# EAGLE design tlcr-raspberry (EAGLE 6.5.0)
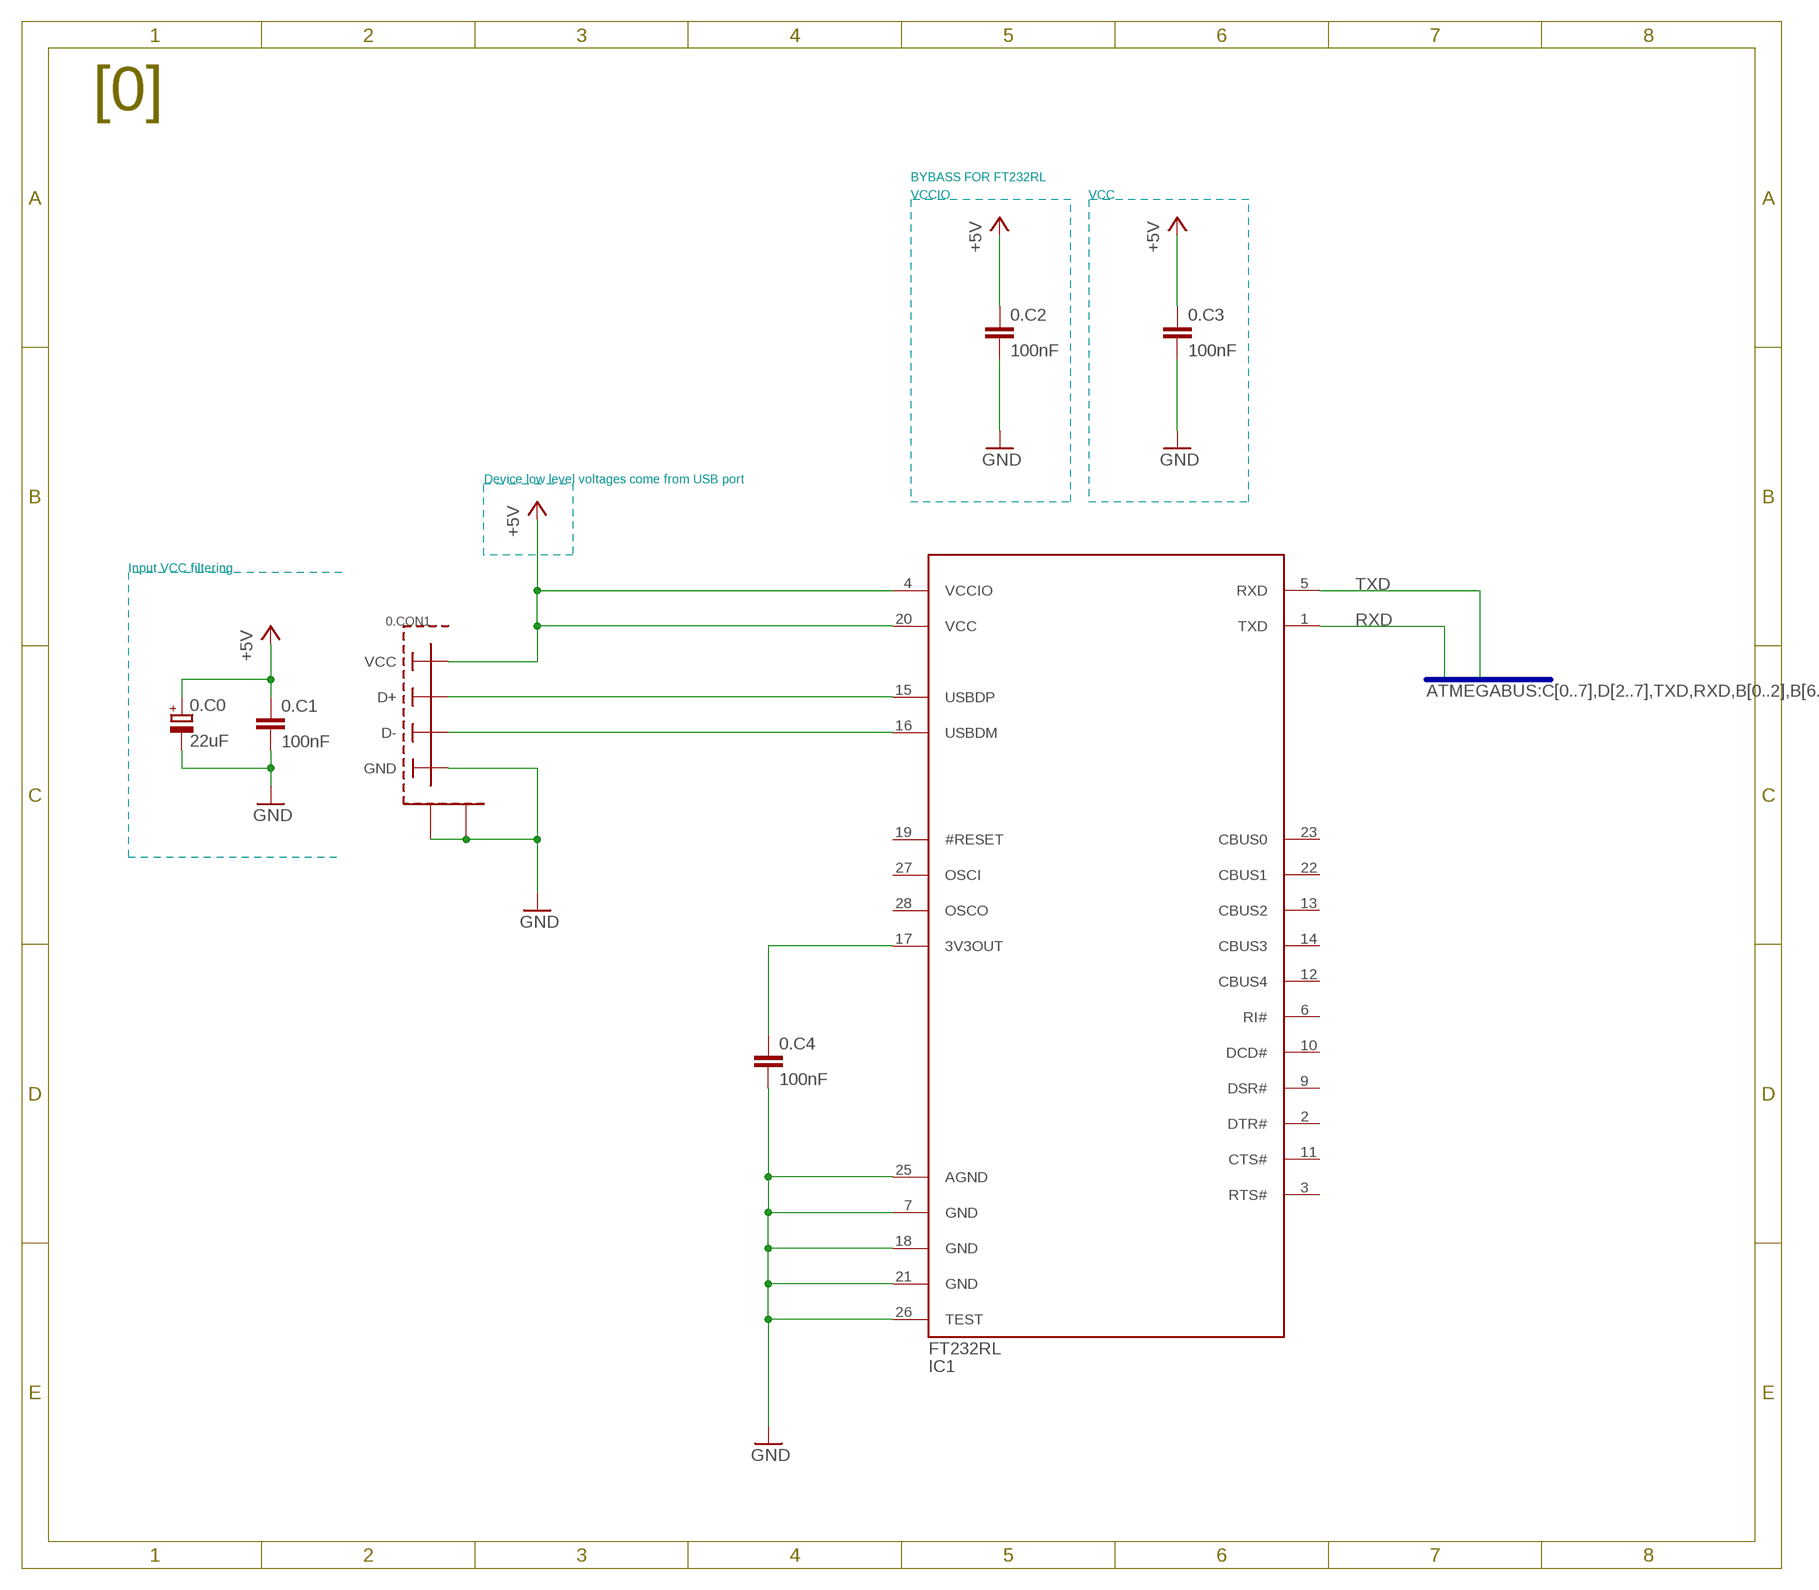
[diagram p0: schematic, sheet 1, part 1 of 2]
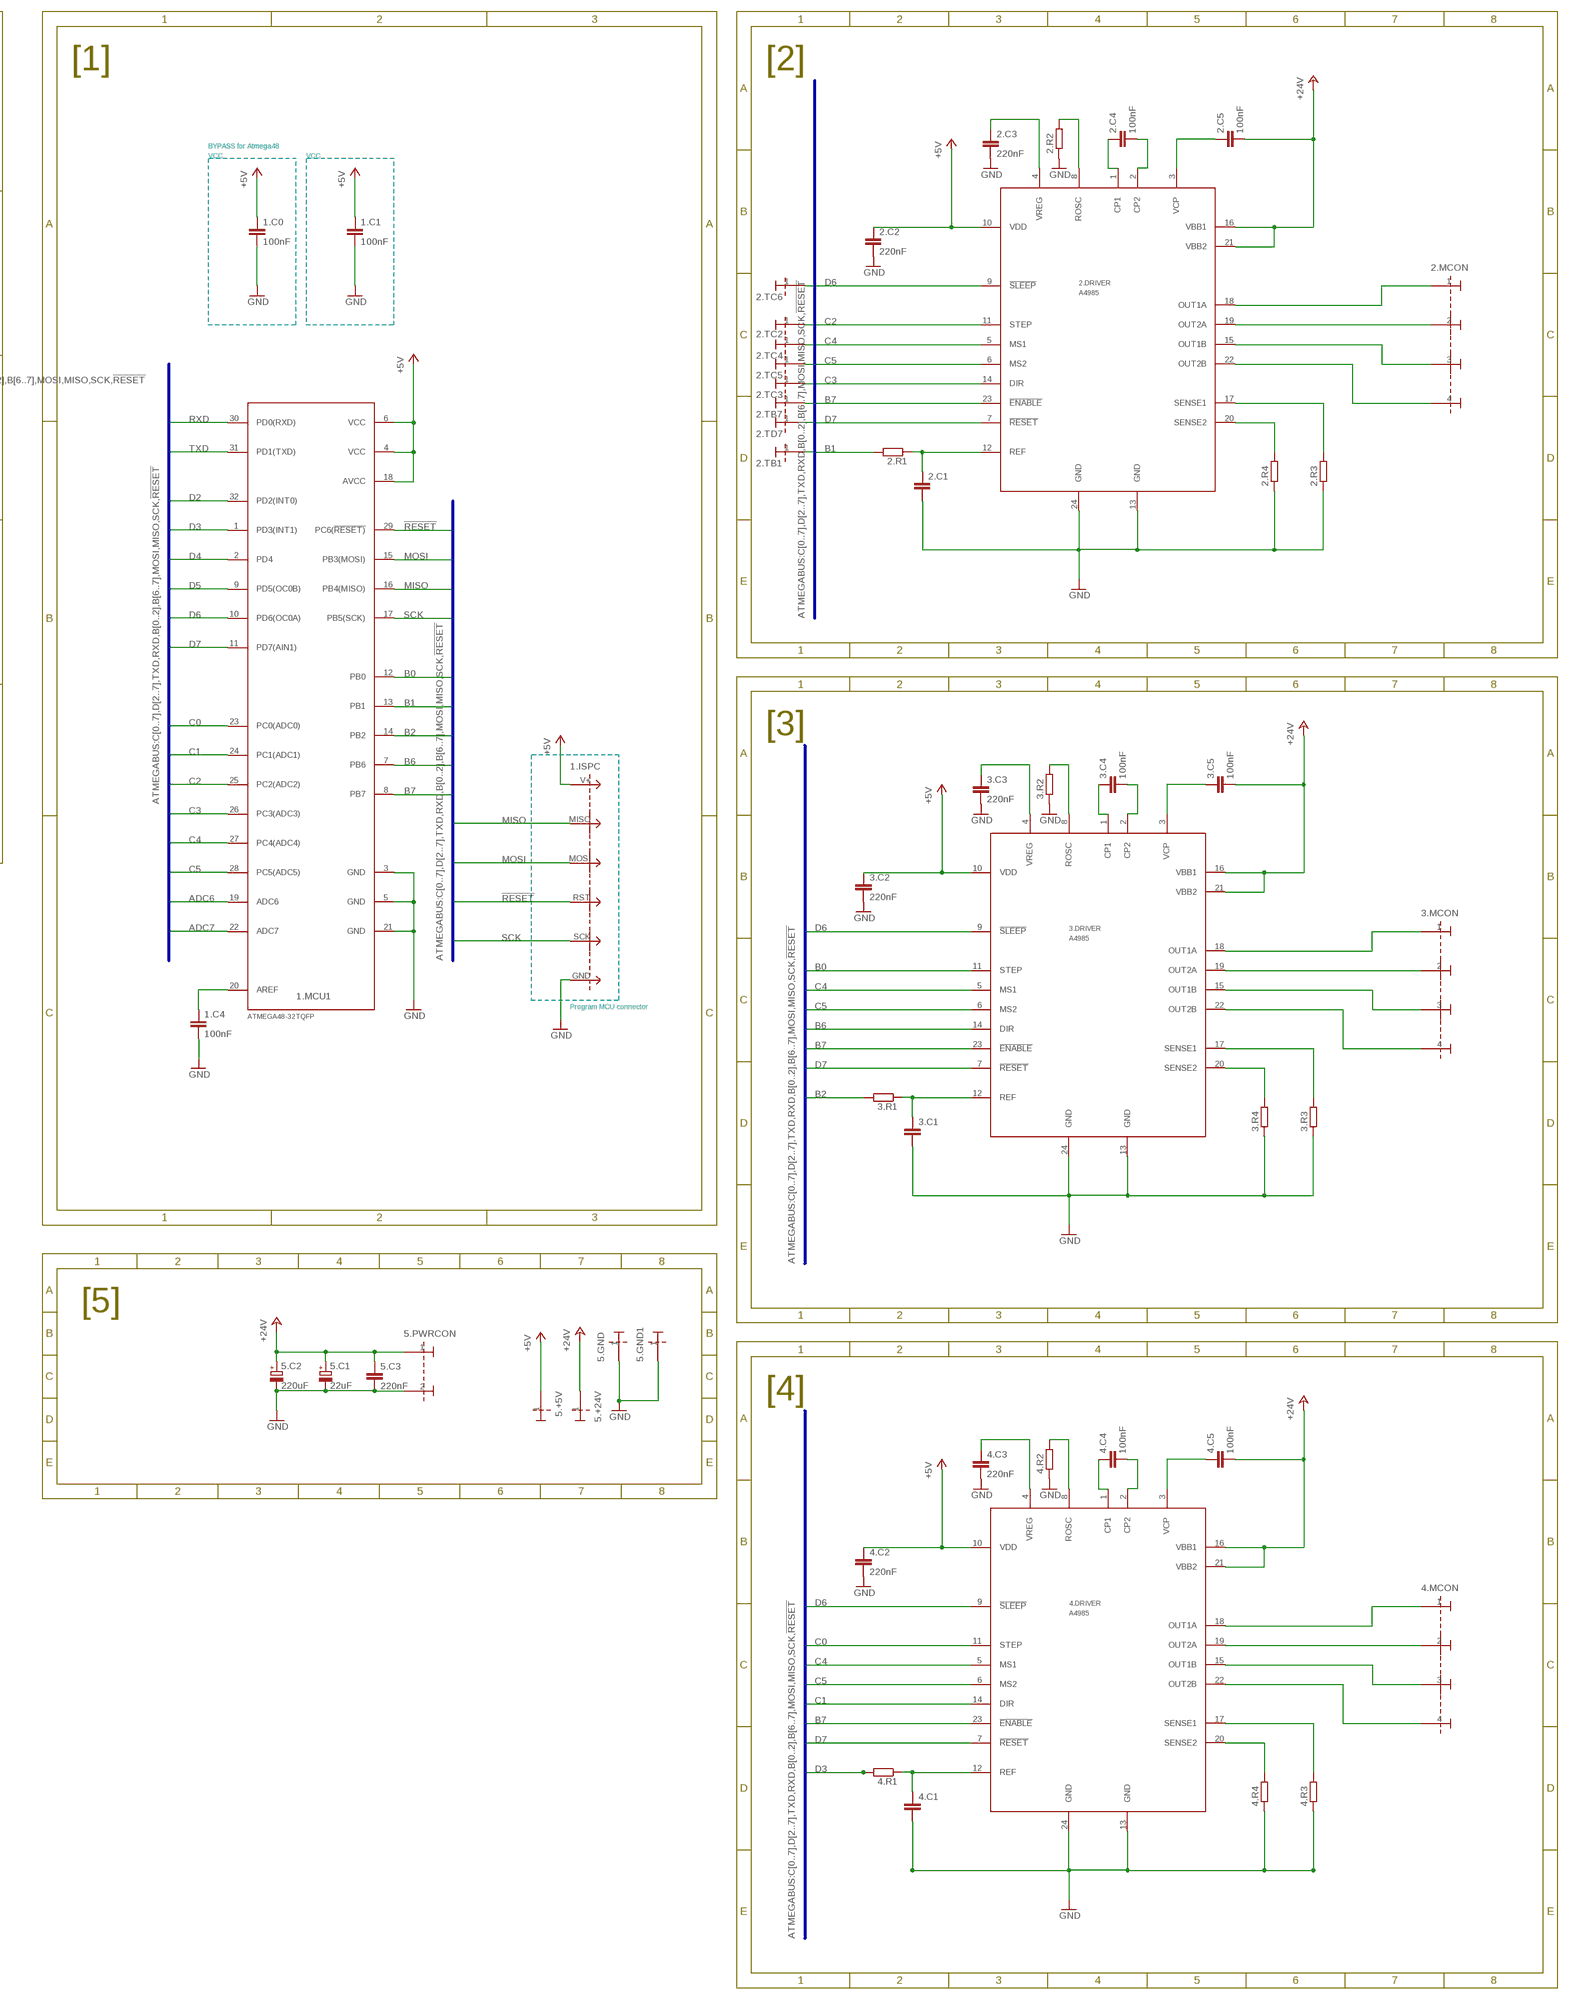
[diagram p1: schematic, sheet 1, part 2 of 2]

## Parts
0.C0  22uF  CPOL-EUE1.5-5  [E1.5-5]
0.C1  100nF  C-EUC0805  [C0805]
0.C2  100nF  C-EUC0805  [C0805]
0.C3  100nF  C-EUC0805  [C0805]
0.C4  100nF  C-EUC0805  [C0805]
0.CON1  USB-BWUERTH-ELECTRONIC-USB-B  [USB-B-THROUGH-HOLE]
1.C0  100nF  C-EUC0805  [C0805]
1.C1  100nF  C-EUC0805  [C0805]
1.C4  100nF  C-EUC0805  [C0805]
1.ISPC  CONNECTOR_6PIN2X3_ISP  [2X3_ISP]
1.MCU1  ATMEGA48-20PU-32TQFPTQFP32  [TQFP32-08]
2.C1  C-EUC0805  [C0805]
2.C2  220nF  C-EUC0805  [C0805]
2.C3  220nF  C-EUC0805  [C0805]
2.C4  100nF  C-EUC0805  [C0805]
2.C5  100nF  C-EUC0805  [C0805]
2.DRIVER  A4985  [SSOP24]
2.MCON  CONNECTOR_4PIN  [1X4_GENERIC]
2.R1  R-EU_R0805  [R0805]
2.R2  R-EU_R0805  [R0805]
2.R3  R-EU_R2010  [R2010]
2.R4  R-EU_R2010  [R2010]
2.TB1  CONNECTOR_1PIN1X1_HEADER  [1X1_GENERIC]
2.TB7  CONNECTOR_1PIN1X1_HEADER  [1X1_GENERIC]
2.TC2  CONNECTOR_1PIN1X1_HEADER  [1X1_GENERIC]
2.TC3  CONNECTOR_1PIN1X1_HEADER  [1X1_GENERIC]
2.TC4  CONNECTOR_1PIN1X1_HEADER  [1X1_GENERIC]
2.TC5  CONNECTOR_1PIN1X1_HEADER  [1X1_GENERIC]
2.TC6  CONNECTOR_1PIN1X1_HEADER  [1X1_GENERIC]
2.TD7  CONNECTOR_1PIN1X1_HEADER  [1X1_GENERIC]
3.C1  C-EUC0805  [C0805]
3.C2  220nF  C-EUC0805  [C0805]
3.C3  220nF  C-EUC0805  [C0805]
3.C4  100nF  C-EUC0805  [C0805]
3.C5  100nF  C-EUC0805  [C0805]
3.DRIVER  A4985  [SSOP24]
3.MCON  CONNECTOR_4PIN  [1X4_GENERIC]
3.R1  R-EU_R0805  [R0805]
3.R2  R-EU_R0805  [R0805]
3.R3  R-EU_R2010  [R2010]
3.R4  R-EU_R2010  [R2010]
4.C1  C-EUC0805  [C0805]
4.C2  220nF  C-EUC0805  [C0805]
4.C3  220nF  C-EUC0805  [C0805]
4.C4  100nF  C-EUC0805  [C0805]
4.C5  100nF  C-EUC0805  [C0805]
4.DRIVER  A4985  [SSOP24]
4.MCON  CONNECTOR_4PIN  [1X4_GENERIC]
4.R1  R-EU_R0805  [R0805]
4.R2  R-EU_R0805  [R0805]
4.R3  R-EU_R2010  [R2010]
4.R4  R-EU_R2010  [R2010]
5.+5V  CONNECTOR_1PIN1X1_HEADER  [1X1_GENERIC]
5.+24V  CONNECTOR_1PIN1X1_HEADER  [1X1_GENERIC]
5.C1  22uF  CPOL-EU140CLH-0810  [140CLH-0810]
5.C2  220uF  CPOL-EU140CLH-0810  [140CLH-0810]
5.C3  220nF  C-EUC0805  [C0805]
5.GND  CONNECTOR_1PIN1X1_HEADER  [1X1_GENERIC]
5.GND1  CONNECTOR_1PIN1X1_HEADER  [1X1_GENERIC]
5.PWRCON  CONNECTOR_2PIN1X2_WIRE  [1X2_WIRE]
IC1  FT232RL  [SSOP28]

## Nets
!RESET: 1.ISPC.RST 1.MCU1.29(PC6(!RESET))
+5V: 0.C0.+ 0.C1.1 0.C2.1 0.C3.1 0.CON1.VCC 1.C0.1 1.C1.1 1.ISPC.V+ 1.MCU1.4(VCC) 1.MCU1.6(VCC) 1.MCU1.18(AVCC) 2.C2.1 2.DRIVER.10(VDD) 3.C2.1 3.DRIVER.10(VDD) 4.C2.1 4.DRIVER.10(VDD) 5.+5V.1 IC1.4(VCCIO) IC1.20(VCC)
+24V: 2.C5.2 2.DRIVER.16(VBB1) 2.DRIVER.21(VBB2) 3.C5.2 3.DRIVER.16(VBB1) 3.DRIVER.21(VBB2) 4.C5.2 4.DRIVER.16(VBB1) 4.DRIVER.21(VBB2) 5.+24V.1 5.C1.+ 5.C2.+ 5.C3.1 5.PWRCON.1
ADC6: 1.MCU1.19(ADC6)
ADC7: 1.MCU1.22(ADC7)
B0: 1.MCU1.12(PB0) 3.DRIVER.11(STEP)
B1: 1.MCU1.13(PB1) 2.R1.2 2.TB1.1
B2: 1.MCU1.14(PB2) 3.R1.2
B6: 1.MCU1.7(PB6) 3.DRIVER.14(DIR)
B7: 1.MCU1.8(PB7) 2.DRIVER.23(!ENABLE) 2.TB7.1 3.DRIVER.23(!ENABLE) 4.DRIVER.23(!ENABLE)
C0: 1.MCU1.23(PC0(ADC0)) 4.DRIVER.11(STEP)
C1: 1.MCU1.24(PC1(ADC1)) 4.DRIVER.14(DIR)
C2: 1.MCU1.25(PC2(ADC2)) 2.DRIVER.11(STEP) 2.TC2.1
C3: 1.MCU1.26(PC3(ADC3)) 2.DRIVER.14(DIR) 2.TC3.1
C4: 1.MCU1.27(PC4(ADC4)) 2.DRIVER.5(MS1) 2.TC4.1 3.DRIVER.5(MS1) 4.DRIVER.5(MS1)
C5: 1.MCU1.28(PC5(ADC5)) 2.DRIVER.6(MS2) 2.TC5.1 3.DRIVER.6(MS2) 4.DRIVER.6(MS2)
D2: 1.MCU1.32(PD2(INT0))
D3: 1.MCU1.1(PD3(INT1)) 4.R1.2
D4: 1.MCU1.2(PD4)
D5: 1.MCU1.9(PD5(OC0B))
D6: 1.MCU1.10(PD6(OC0A)) 2.DRIVER.9(!SLEEP) 2.TC6.1 3.DRIVER.9(!SLEEP) 4.DRIVER.9(!SLEEP)
D7: 1.MCU1.11(PD7(AIN1)) 2.DRIVER.7(!RESET) 2.TD7.1 3.DRIVER.7(!RESET) 4.DRIVER.7(!RESET)
GND: 0.C0.- 0.C1.2 0.C2.2 0.C3.2 0.C4.2 0.CON1.GND 0.CON1.SHIELD 0.CON1.SHIELD@2(SHIELD) 1.C0.2 1.C1.2 1.C4.2 1.ISPC.GND 1.MCU1.3(GND) 1.MCU1.5(GND) 1.MCU1.21(GND) 2.C1.2 2.C2.2 2.C3.2 2.DRIVER.13(GND) 2.DRIVER.24(GND) 2.R2.1 2.R3.1 2.R4.1 3.C1.2 3.C2.2 3.C3.2 3.DRIVER.13(GND) 3.DRIVER.24(GND) 3.R2.1 3.R3.1 3.R4.1 4.C1.2 4.C2.2 4.C3.2 4.DRIVER.13(GND) 4.DRIVER.24(GND) 4.R2.1 4.R3.1 4.R4.1 5.C1.- 5.C2.- 5.C3.2 5.GND1.1 5.GND.1 5.PWRCON.2 IC1.7(GND) IC1.18(GND) IC1.21(GND) IC1.25(AGND) IC1.26(TEST)
MISO: 1.ISPC.MISO 1.MCU1.16(PB4(MISO))
MOSI: 1.ISPC.MOSI 1.MCU1.15(PB3(MOSI))
N$1: 1.C4.1 1.MCU1.20(AREF)
N$2: 2.C3.1 2.DRIVER.4(VREG)
N$3: 0.CON1.D+ IC1.15(USBDP)
N$4: 0.CON1.D- IC1.16(USBDM)
N$5: 2.C4.1 2.DRIVER.1(CP1)
N$6: 2.C4.2 2.DRIVER.2(CP2)
N$7: 0.C4.1 IC1.17(3V3OUT)
N$8: 2.C5.1 2.DRIVER.3(VCP)
N$9: 3.C3.1 3.DRIVER.4(VREG)
N$10: 2.DRIVER.18(OUT1A) 2.MCON.1
N$11: 2.DRIVER.19(OUT2A) 2.MCON.2
N$12: 2.DRIVER.15(OUT1B) 2.MCON.3
N$13: 2.DRIVER.22(OUT2B) 2.MCON.4
N$14: 2.DRIVER.17(SENSE1) 2.R3.2
N$15: 2.DRIVER.20(SENSE2) 2.R4.2
N$16: 3.C4.1 3.DRIVER.1(CP1)
N$18: 3.C4.2 3.DRIVER.2(CP2)
N$19: 2.DRIVER.8(ROSC) 2.R2.2
N$20: 3.C5.1 3.DRIVER.3(VCP)
N$21: 3.DRIVER.18(OUT1A) 3.MCON.1
N$22: 3.DRIVER.19(OUT2A) 3.MCON.2
N$23: 3.DRIVER.15(OUT1B) 3.MCON.3
N$24: 3.DRIVER.22(OUT2B) 3.MCON.4
N$25: 3.DRIVER.17(SENSE1) 3.R3.2
N$26: 3.DRIVER.20(SENSE2) 3.R4.2
N$28: 3.DRIVER.8(ROSC) 3.R2.2
N$29: 4.C3.1 4.DRIVER.4(VREG)
N$30: 4.C4.1 4.DRIVER.1(CP1)
N$31: 4.C4.2 4.DRIVER.2(CP2)
N$32: 4.C5.1 4.DRIVER.3(VCP)
N$33: 4.DRIVER.18(OUT1A) 4.MCON.1
N$34: 4.DRIVER.19(OUT2A) 4.MCON.2
N$35: 4.DRIVER.15(OUT1B) 4.MCON.3
N$36: 4.DRIVER.22(OUT2B) 4.MCON.4
N$37: 4.DRIVER.17(SENSE1) 4.R3.2
N$38: 4.DRIVER.20(SENSE2) 4.R4.2
N$40: 4.DRIVER.8(ROSC) 4.R2.2
N$41: 3.C1.1 3.DRIVER.12(REF) 3.R1.1
N$43: 4.C1.1 4.DRIVER.12(REF) 4.R1.1
N$45: 2.C1.1 2.DRIVER.12(REF) 2.R1.1
RXD: 1.MCU1.30(PD0(RXD)) IC1.1(TXD)
SCK: 1.ISPC.SCK 1.MCU1.17(PB5(SCK))
TXD: 1.MCU1.31(PD1(TXD)) IC1.5(RXD)
Unconnected: IC1.2(DTR#) IC1.3(RTS#) IC1.6(RI#) IC1.9(DSR#) IC1.10(DCD#) IC1.11(CTS#) IC1.12(CBUS4) IC1.13(CBUS2) IC1.14(CBUS3) IC1.19(#RESET) IC1.22(CBUS1) IC1.23(CBUS0) IC1.27(OSCI) IC1.28(OSCO)

## Buses
ATMEGABUS:C[0..7],D[2..7],TXD,RXD,B[0..2],B[6..7],MOSI,MISO,SCK,!RESET

## Notes on the sheet
- [0] | [1] | [2]
- BYBASS FOR FT232RL
- VCCIO | VCC
- BYPASS for Atmega48
- VCC | VCC
- Device low level voltages come from USB port
- Input VCC filtering
- [3]
- Program MCU connector
- [5]
- [4]

## Library data of the parts
0.C0 5.C1 5.C2 = RC_and_L:CPOL-EU: POLARIZED CAPACITOR, European symbol
0.C1-0.C4 1.C0 1.C1 1.C4 2.C1-2.C5 3.C1-3.C5 4.C1-4.C5 5.C3 = RC_and_L:C-EU: CAPACITOR, European symbol
0.CON1 = connectors:USB-B: USB, type B connector.; DATASHEET: http://www.farnell.com/datasheets/1442182.pdf; FARNELL: http://fi.farnell.com/jsp/search/productdetail.jsp?SKU=1642035
1.ISPC = connectors:CONNECTOR_6PIN
1.MCU1 = ic:ATMEGA48-20PU-32TQFP
2.DRIVER 3.DRIVER 4.DRIVER = ic:A4985: DMOS Microstepping Driver with Translator And Overcurrent Protection Datasheet <http://www.farnell.com/datasheets/1481256.pdf>
2.MCON 3.MCON 4.MCON = connectors:CONNECTOR_4PIN; PIN1: 1A; PIN2: 2A; PIN3: 1B; PIN4: 2B
2.R1-2.R4 3.R1-3.R4 4.R1-4.R4 = RC_and_L:R-EU_: RESISTOR, European symbol
2.TB1 2.TB7 2.TC2-2.TC6 2.TD7 5.+5V 5.+24V 5.GND 5.GND1 = connectors:CONNECTOR_1PIN
5.PWRCON = connectors:CONNECTOR_2PIN; PIN1: 24V; PIN2: GND
IC1 = ic:FT232RL: FTDI - FT232RL - IC, USB TO UART, SMD, SSOP28, 232; DATASHEET: http://www.farnell.com/datasheets/11529.pdf; FARNELL: http://fi.farnell.com/ftdi/ft232rl/ic-usb-to-uart-smd-ssop28-232/dp/1146032

## Net classes
0 default: width 0.305 mm
1 +24V: width 0.61 mm, clearance 0.305 mm
2 +24V_SIGNAL: width 0.61 mm, clearance 0.305 mm

## Board
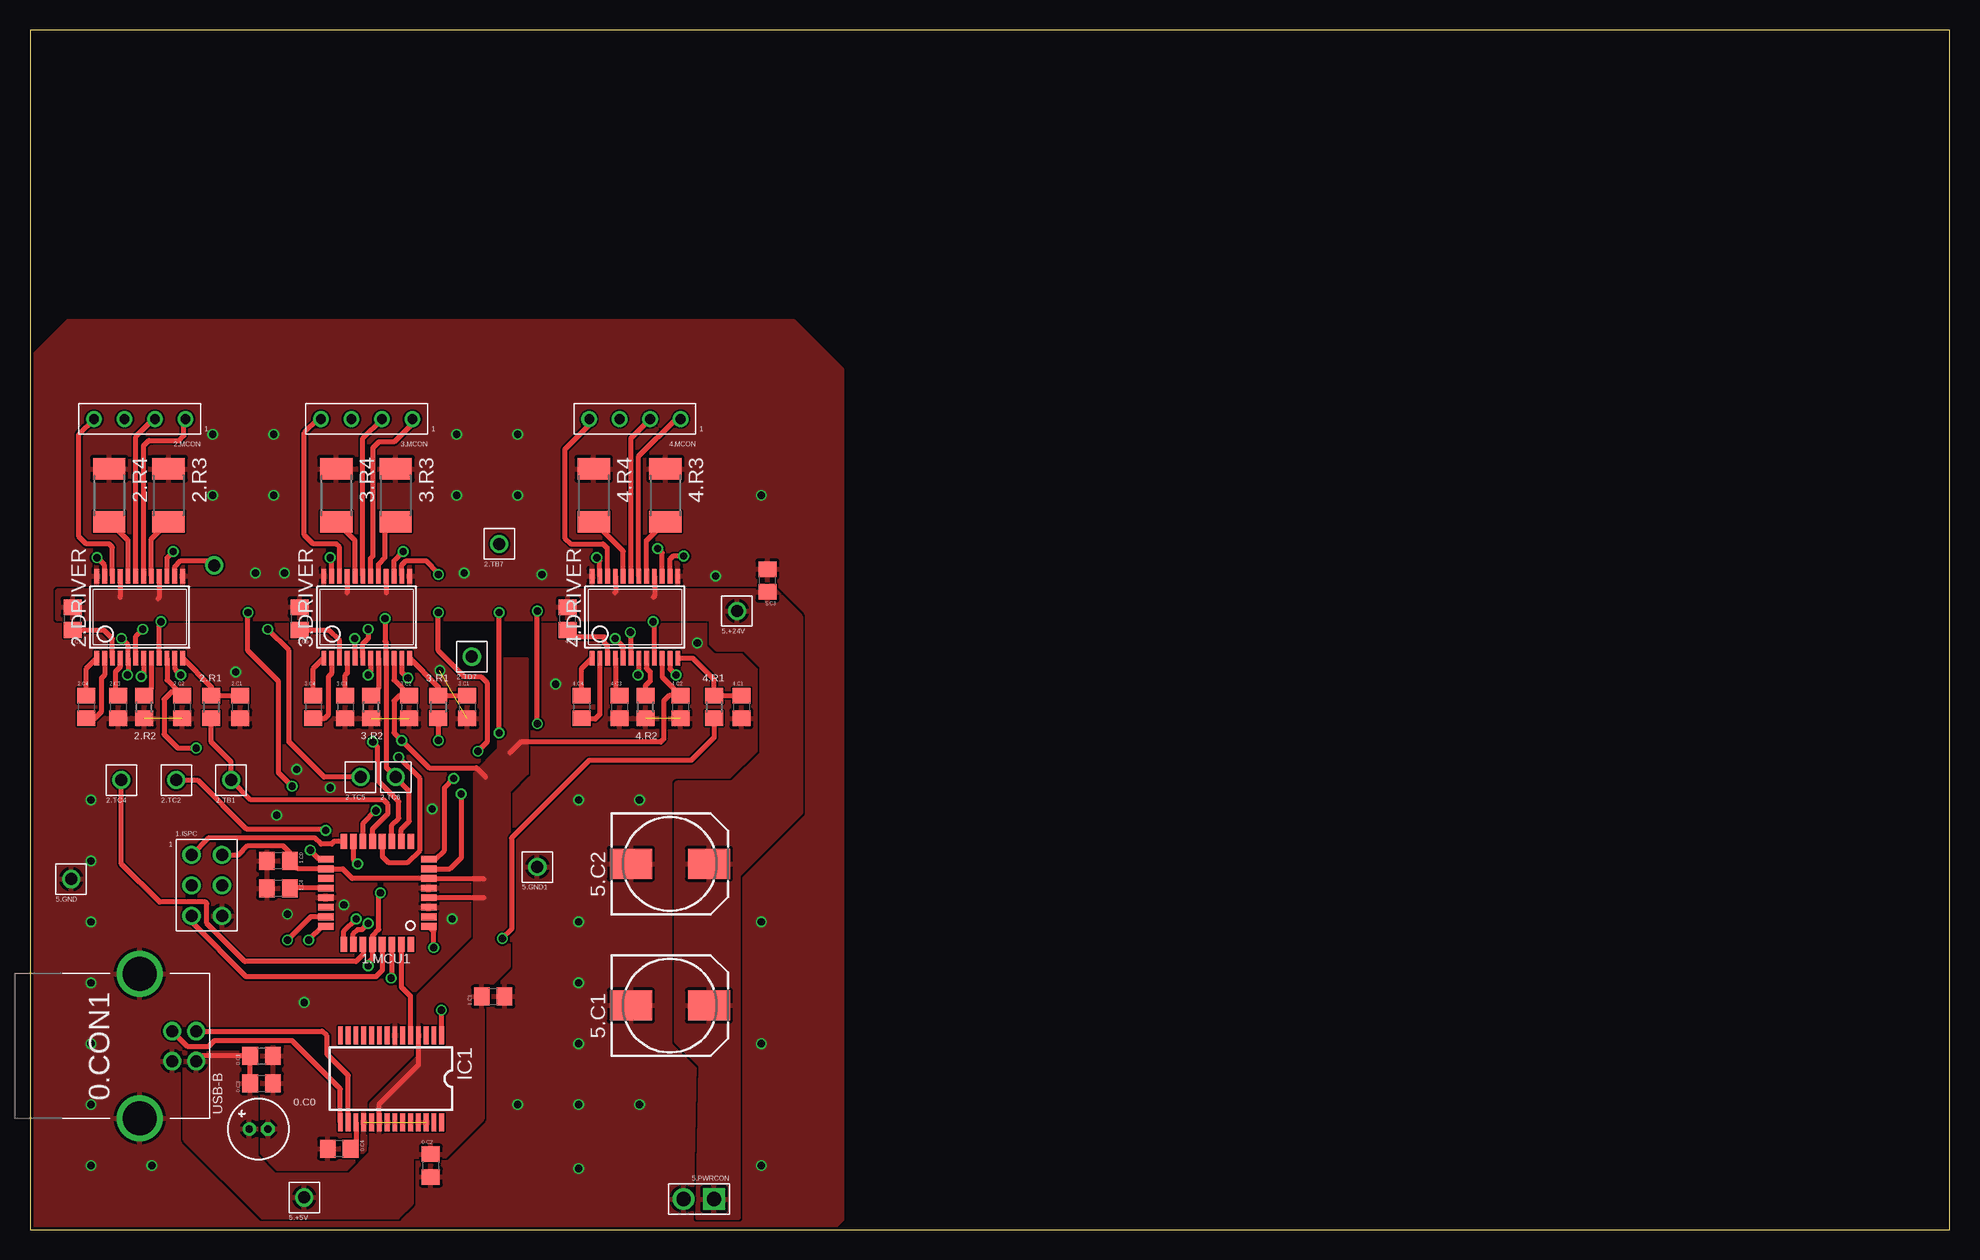
[diagram p2: board, top side]
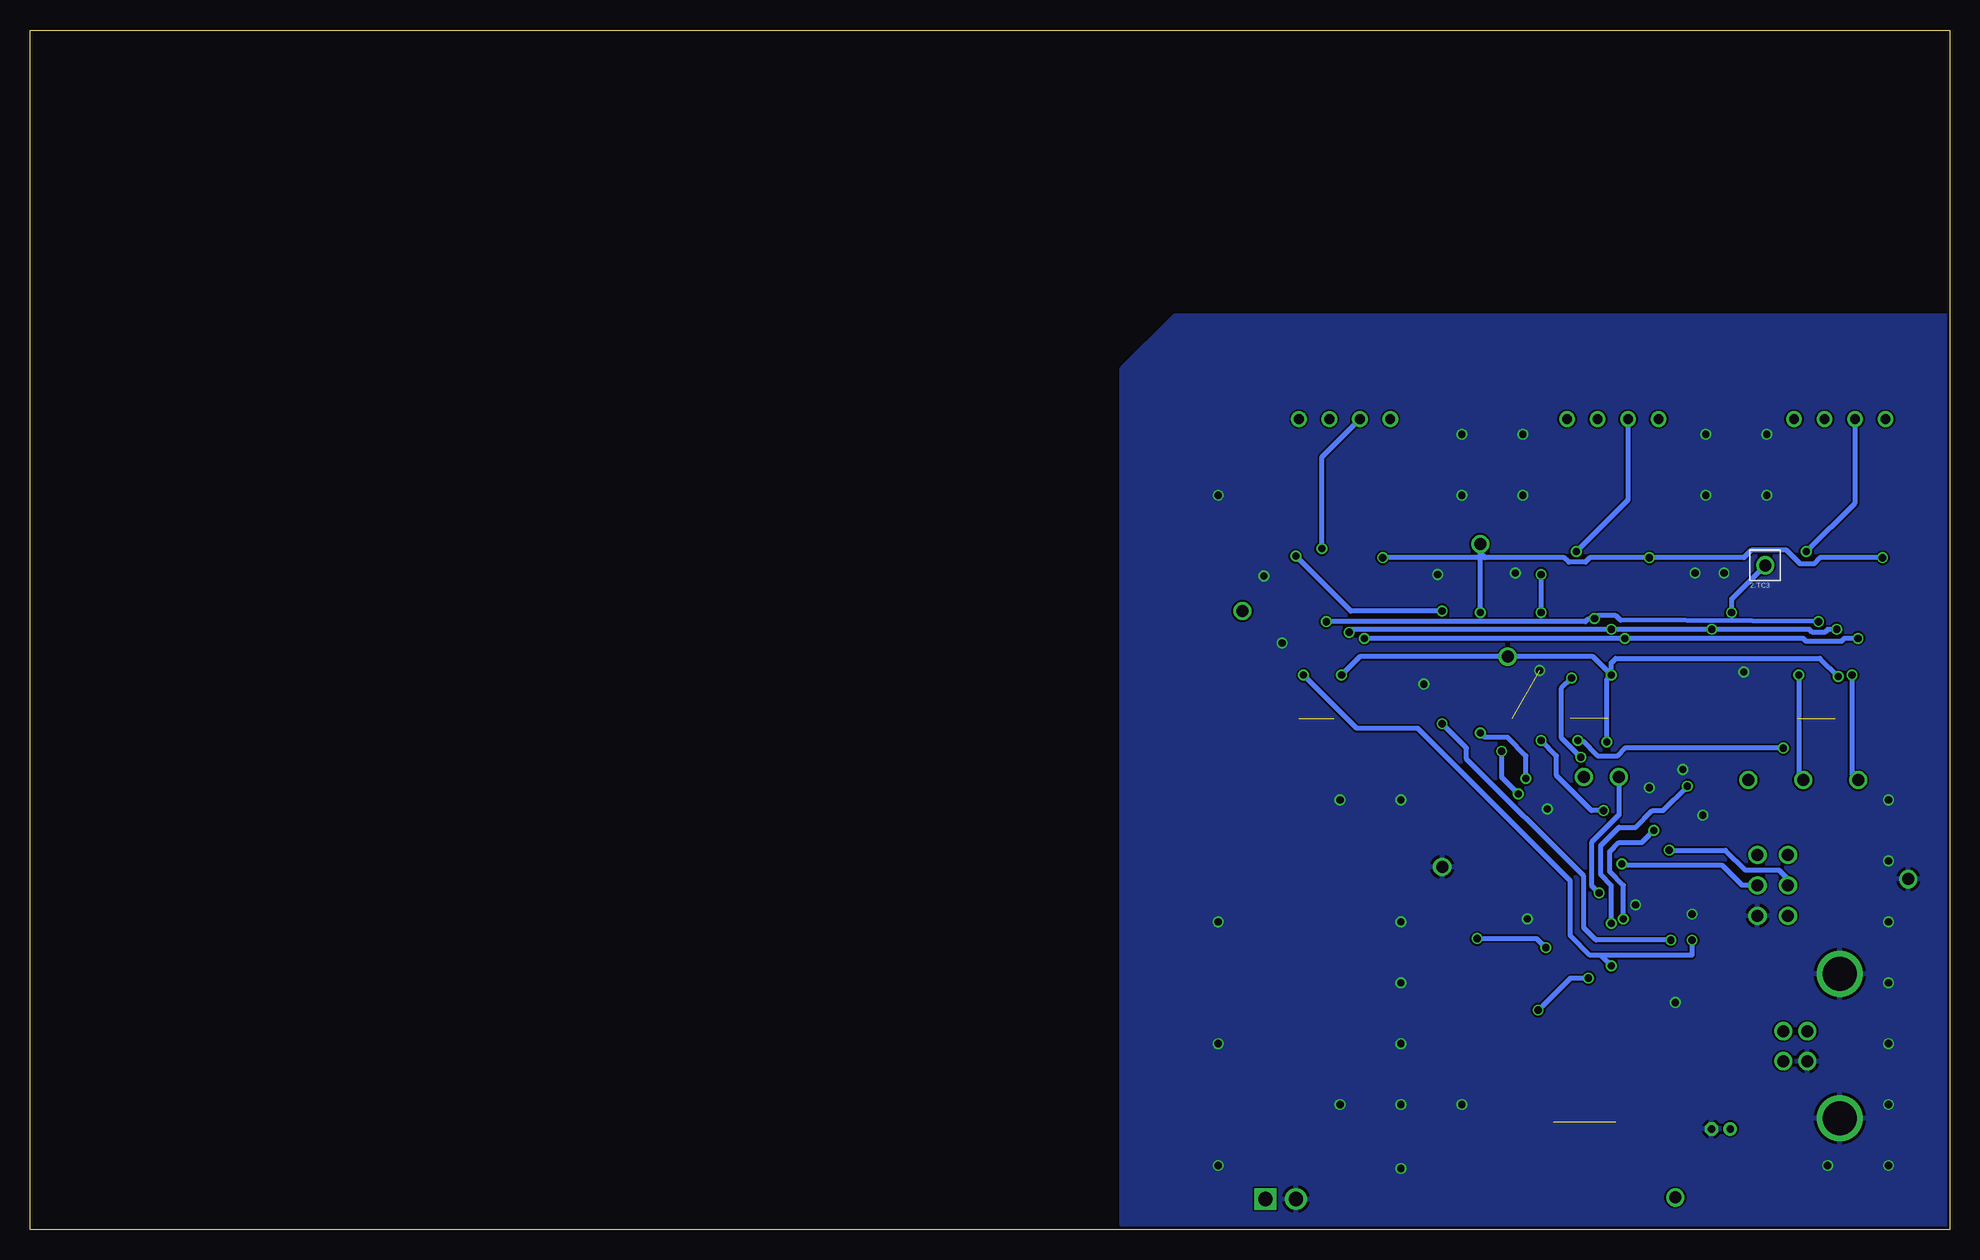
[diagram p3: board, bottom side, seen from below]

Size 160 x 100 mm. Coordinates in mm from the lower left corner, seen from the top.
Outline: 0,0 160,0 160,100 0,100 0,0
Copper layers (1*16): Top 0.035mm / dielectric 1.5mm / Bottom 0.035mm
Design rules "ITead_rule": minimum track width 6mil, minimum drill 12mil, track to track 6mil, track to pad 6mil, pad to pad 6mil, via to via 6mil, smd to smd 0mil, copper to edge 10mil, drill to drill 10mil, minimum pad ring 10mil, minimum via ring 6mil, stop-mask expansion 2mil, vias tented up to drill 100mil, thermal gap 10mil

### Footprints (pad centres in the part's own frame; a part is rotated, then mirrored left to right if it is on the bottom)
E1.5-5 = drill 0.6: + -0.77,0 | drill 0.6 octagon: - 0.79,0
C0805 = smd 1.3 x 1.5: 1 -0.95,0; 2 0.95,0
USB-B-THROUGH-HOLE = drill 1: D+ 7.27,-2.71; D- 7.27,-4.71; GND 4.77,-2.71; VCC 4.77,-4.71 | drill 2.8: SHIELD 0,0; SHIELD@2 12.04,0
2X3_ISP = drill 1: GND 1.27,-5.08; MISO -1.27,0; MOSI 1.27,-2.54; RST -1.27,-5.08; SCK -1.27,-2.54; V+ 1.27,0
TQFP32-08 = smd 1.27 x 0.559: 1 -4.293,2.8; 2 -4.293,2; 3 -4.293,1.2; 4 -4.293,0.4; 5 -4.293,-0.4; 6 -4.293,-1.2; 7 -4.293,-2; 8 -4.293,-2.8; 17 4.293,-2.8; 18 4.293,-2; 19 4.293,-1.2; 20 4.293,-0.4; 21 4.293,0.4; 22 4.293,1.2; 23 4.293,2; 24 4.293,2.8 | smd 0.559 x 1.27: 9 -2.8,-4.293; 10 -2,-4.293; 11 -1.2,-4.293; 12 -0.4,-4.293; 13 0.4,-4.293; 14 1.2,-4.293; 15 2,-4.293; 16 2.8,-4.293; 25 2.8,4.293; 26 2,4.293; 27 1.2,4.293; 28 0.4,4.293; 29 -0.4,4.293; 30 -1.2,4.293; 31 -2,4.293; 32 -2.8,4.293
SSOP24 = smd 0.4 x 1.2: 1 -3.575,-3.42; 2 -2.925,-3.42; 3 -2.275,-3.42; 4 -1.625,-3.42; 5 -0.975,-3.42; 6 -0.325,-3.42; 7 0.325,-3.42; 8 0.975,-3.42; 9 1.625,-3.42; 10 2.275,-3.42; 11 2.925,-3.42; 12 3.575,-3.42; 13 3.575,3.42; 14 2.925,3.42; 15 2.275,3.42; 16 1.625,3.42; 17 0.975,3.42; 18 0.325,3.42; 19 -0.325,3.42; 20 -0.975,3.42; 21 -1.625,3.42; 22 -2.275,3.42; 23 -2.925,3.42; 24 -3.575,3.42
1X4_GENERIC = drill 0.8: 1 -1.27,0; 2 1.27,0; 3 3.81,0; 4 6.35,0
R0805 = smd 1.3 x 1.5: 1 -0.95,0; 2 0.95,0
R2010 = smd 1.8 x 2.7: 1 -2.2,0; 2 2.2,0
1X1_GENERIC = drill 1: 1 0,0
140CLH-0810 = smd 3.5 x 2.5: + 3.25,0; - -3.25,0
1X2_WIRE = drill 1.2 square: 1 -1.27,0 | drill 1.2: 2 1.27,0
SSOP28 = smd 0.4 x 1.5: 1 -4.225,-3.625; 2 -3.575,-3.625; 3 -2.925,-3.625; 4 -2.275,-3.625; 5 -1.625,-3.625; 6 -0.975,-3.625; 7 -0.325,-3.625; 8 0.325,-3.625; 9 0.975,-3.625; 10 1.625,-3.625; 11 2.275,-3.625; 12 2.925,-3.625; 13 3.575,-3.625; 14 4.225,-3.625; 15 4.225,3.625; 16 3.575,3.625; 17 2.925,3.625; 18 2.275,3.625; 19 1.625,3.625; 20 0.975,3.625; 21 0.325,3.625; 22 -0.325,3.625; 23 -0.975,3.625; 24 -1.625,3.625; 25 -2.275,3.625; 26 -2.925,3.625; 27 -3.575,3.625; 28 -4.225,3.625

### Placement (x,y rotation side)
0.C0  19.05,8.38 0 top
0.C1  19.3,14.48 0 top
0.C2  33.4,5.33 270 top
0.C3  19.3,12.19 0 top
0.C4  25.78,6.73 180 top
0.CON1  9.14,9.27 90 top
1.C0  20.7,30.73 180 top
1.C1  38.61,19.43 0 top
1.C4  20.7,28.45 180 top
1.ISPC  14.73,31.24 0 top
1.MCU1  28.96,28.07 180 top
2.C1  17.53,43.56 270 top
2.C2  12.7,43.56 270 top
2.C3  7.37,43.56 270 top
2.C4  4.7,43.56 270 top
2.C5  3.56,50.93 90 top
2.DRIVER  9.14,51.05 0 top
2.MCON  11.68,67.56 180 top
2.R1  15.11,43.56 270 top
2.R2  9.53,43.56 90 top
2.R3  11.56,61.21 270 top
2.R4  6.6,61.21 270 top
2.TB1  16.76,37.47 0 top
2.TB7  39.12,57.15 0 top
2.TC2  12.19,37.47 0 top
2.TC3  15.37,55.37 0 bottom
2.TC4  7.62,37.47 0 top
2.TC5  27.56,37.72 0 top
2.TC6  30.48,37.72 0 top
2.TD7  36.83,47.75 0 top
3.C1  36.45,43.56 270 top
3.C2  31.62,43.56 270 top
3.C3  26.29,43.56 270 top
3.C4  23.62,43.56 270 top
3.C5  22.48,50.93 90 top
3.DRIVER  28.07,51.05 0 top
3.MCON  30.61,67.56 180 top
3.R1  34.04,43.56 270 top
3.R2  28.45,43.56 90 top
3.R3  30.48,61.21 270 top
3.R4  25.53,61.21 270 top
4.C1  59.31,43.56 270 top
4.C2  54.23,43.56 270 top
4.C3  49.15,43.56 270 top
4.C4  45.97,43.56 270 top
4.C5  44.83,50.93 90 top
4.DRIVER  50.42,51.05 0 top
4.MCON  52.96,67.56 180 top
4.R1  57.02,43.56 270 top
4.R2  51.31,43.56 90 top
4.R3  52.96,61.21 270 top
4.R4  46.99,61.21 270 top
5.+5V  22.86,2.67 0 top
5.+24V  58.93,51.56 0 top
5.C1  53.34,18.67 0 top
5.C2  53.34,30.48 0 top
5.C3  61.47,54.1 90 top
5.GND  3.43,29.21 0 top
5.GND1  42.29,30.23 0 top
5.PWRCON  55.75,2.54 180 top
IC1  30.1,12.57 180 top

### Tracks (layer width: path | path; a pad name or v marks a point on that pad's centre or on a via)
!RESET
  Top 0.406: 1.ISPC.RST 13.46,25.65 18.03,21.08 28.83,21.08 29.36,21.61 1.MCU1.29
+5V  (via drill 0.6)
  Top 0.406: 2.DRIVER.10 11.42,45.79 12.38,44.83 | 12.38,44.83 2.C2.1 | IC1.4 32.37,13.71 29.12,10.46 IC1.20 | 1.ISPC.V+ 17.4,31.24 18.16,32 21.08,32 21.65,31.43 1.C0.1 22.32,30.07 1.MCU1.18 26.07,30.07 26.87,29.27 1.MCU1.6 37.79,29.27 37.85,29.21 | 0.CON1.VCC 14.29,14.48 0.C1.1 0.C3.1 | 1.MCU1.4 37.83,27.67 37.85,27.69 | 3.DRIVER.10 30.34,45.79 3.C2.1 30.8,44.51 30.35,44.07 30.35,41.4 v30.99,40.77 33.27,38.48 37.21,38.48 37.97,37.72 | 4.DRIVER.10 52.69,46.05 4.C2.1 53.27,44.51 52.83,44.07 52.83,40.89 52.58,40.64 40.89,40.64 40.01,39.75 | 12.38,44.83 11.81,44.83 11.18,44.2 11.18,41.27 12.32,40.13 v13.84,40.13
  Bottom 0.406: v13.84,40.13 27.05,40.13 27.69,39.5 29.34,39.5 30.61,40.77 v30.99,40.77
  pour Top: 39.12,47.5 39.12,40.01 37.08,37.97 37.08,24.13 32.38,19.43 32.38,14.35 28.45,10.41 28.45,6.48 28.83,6.1 34.54,6.1 37.72,9.27 37.72,19.81 39.88,21.97 39.88,36.58 41.4,38.1 41.4,47.5
  pour Top: 31.75,6.86 31.75,2.16 30.61,1.02 19.43,1.02 12.95,7.49 12.95,14.22 13.46,14.73 18.67,14.73 18.8,14.61 18.8,6.1 20.32,4.57 26.67,4.57 28.45,6.35 28.45,6.86 28.57,6.99 31.62,6.99
+24V
  Top 0.406: 3.DRIVER.21 26.44,53.11 26.42,53.09 | 3.DRIVER.16 29.69,53.11 29.72,53.09 | 4.DRIVER.21 48.79,53.11 48.77,53.09 | 4.DRIVER.16 52.04,52.81 51.94,52.7 | 2.DRIVER.21 7.52,52.73 7.49,52.7 | 2.DRIVER.16 10.77,52.68 10.67,52.58
  pour Top: 60.45,53.21 2.29,53.21 2.29,50.93 60.45,50.93
  pour Top: 53.85,37.08 53.85,15.75 55.88,13.72 55.63,1.02 59.05,1.02 59.05,29.59 64.26,34.8 64.26,51.05 62.1,53.21 56.77,53.21 56.77,48.9 57.28,48.39 59.56,48.39 60.96,46.99 60.96,39.62 58.55,37.21 53.98,37.21
B0  (via drill 0.6)
  Top 0.406: 1.MCU1.12 29.36,31.1 29.84,30.61 31.5,30.61 32.51,31.62 32.51,37.59 v30.73,39.37 | v31.5,45.97 30.99,46.48 3.DRIVER.11
  Bottom 0.406: v31.5,45.97 32.38,45.09 32.38,41.02 v30.73,39.37
B1
  Top 0.406: 2.R1.2 15.11,40.64 16.76,38.99 2.TB1.1 18.41,35.81 29.46,35.81 29.84,35.43 29.84,34.67 28.56,33.38 1.MCU1.13
B2  (via drill 0.6)
  Top 0.406: 1.MCU1.14 27.76,33.85 v28.83,34.92 | 3.R1.2 v34.04,40.77
  Bottom 0.406: v28.83,34.92 29.84,34.92 32.77,37.85 32.77,39.5 v34.04,40.77
B6  (via drill 0.6)
  Top 0.406: 1.MCU1.7 35.02,30.07 35.94,30.99 v35.94,36.32 | v34.04,51.44 34.04,48.26 36.2,46.1 37.59,46.1 38.1,45.59 38.1,40.64 v37.34,39.88 | v34.04,54.61 34.04,54.74 33.02,55.75 31.37,55.75 30.99,55.38 3.DRIVER.14
  Bottom 0.406: v34.04,51.44 v34.04,54.61 | v37.34,39.88 37.34,37.72 v35.94,36.32
B7  (via drill 0.6)
  Top 0.406: 33.28,30.87 1.MCU1.8 33.79,30.87 34.54,31.62 34.54,36.83 v35.31,37.59 | 2.DRIVER.23 6.22,55.38 v5.59,56.01 | 4.DRIVER.23 47.49,55.76 v47.24,56.01 | 3.DRIVER.23 25.14,55.88 v25.02,56.01 | v39.12,41.4 v39.12,51.44
  Bottom 0.406: v5.59,56.01 10.79,56.01 11.3,55.5 12.45,55.5 13.59,56.64 16.51,56.64 17.14,56.01 v25.02,56.01 29.97,56.01 30.35,55.63 31.75,55.63 32.13,56.01 38.73,56.01 | 38.73,56.01 v47.24,56.01 | 2.TB7.1 39.12,56.39 | 39.12,56.39 38.73,56.01 | v35.31,37.59 35.31,39.5 36.83,41.02 38.73,41.02 v39.12,41.4 | v39.12,51.44 39.12,56.39
C0  (via drill 0.6)
  Top 0.406: 1.MCU1.23 23.4,26.07 v21.46,24.13 | v53.85,46.23 53.34,46.73 4.DRIVER.11
  Bottom 0.406: v21.46,24.13 21.46,22.86 29.97,22.86 31.62,24.51 31.62,29.08 44.32,41.78 49.4,41.78 v53.85,46.23
C1  (via drill 0.6)
  Top 0.406: 1.MCU1.24 24.38,25.27 v23.24,24.13 | v42.29,42.16 v42.29,51.56 | v54.48,56.13 53.59,56.13 53.34,55.88 4.DRIVER.14
  Bottom 0.406: v23.24,24.13 29.46,24.13 30.48,25.15 30.48,29.46 40.26,39.24 40.26,40.13 v42.29,42.16 | v42.29,51.56 49.91,51.56 v54.48,56.13
C2  (via drill 0.6)
  Top 0.406: 2.DRIVER.11 12.07,46.73 v12.57,46.23 | 2.TC2.1 13.97,37.47 18.03,33.4 24.51,33.4 v24.64,33.27 | 1.MCU1.25 26.16,24.89 v27.18,25.91
  Bottom 0.406: 24.77,33.27 v24.64,33.27 25.65,32.26 27.56,32.26 28.32,31.5 28.32,29.84 27.18,28.7 v27.18,25.91 | v12.57,46.23 12.57,37.85 2.TC2.1
C3  (via drill 0.6)
  Top 0.406: 2.DRIVER.14 12.07,55.25 12.57,55.75 14.99,55.75 2.TC3.1 | 1.MCU1.26 26.96,24.67 27.3,25.02 27.69,25.02 v28.19,25.53 | v18.16,51.44 18.16,48.26 20.7,45.72 20.7,38.1 v21.84,36.96
  Bottom 0.406: v28.19,25.53 28.19,28.7 29.08,29.59 29.08,32 27.56,33.53 26.16,33.53 24.77,34.92 23.88,34.92 v21.84,36.96 | v18.16,51.44 18.16,52.58 2.TC3.1
C4  (via drill 0.6)
  Top 0.406: v8.13,46.23 8.17,46.27 2.DRIVER.5 8.17,48.73 v7.62,49.28 | 4.DRIVER.5 49.44,48.6 v48.77,49.28 48.9,49.28 49.02,49.15 | 27.05,49.15 v27.05,49.28 27.09,49.23 3.DRIVER.5 | 1.MCU1.27 27.76,22.93 27.18,22.35 17.91,22.35 14.73,25.53 14.73,27.18 14.61,27.3 10.79,27.3 7.62,30.48 2.TC4.1
  Bottom 0.406: v7.62,49.28 8.76,49.28 9.02,49.02 11.94,49.02 12.19,49.28 v27.05,49.28 v48.77,49.28 | v8.13,46.23 8.13,37.97 2.TC4.1
C5  (via drill 0.6)
  Top 0.406: 2.DRIVER.6 8.82,49.46 v9.4,50.04 | 4.DRIVER.6 50.09,49.73 v50.04,49.78 | v28.19,50.04 28.19,49.28 27.74,48.82 3.DRIVER.6 | v28.19,21.97 28.19,22.23 28.57,22.61 28.57,23.75 1.MCU1.28 28.56,24.49 29.08,25.02 29.08,27.94 v29.21,28.07 | 2.TC5.1 24.51,37.72 21.59,40.64 21.59,48.26 v19.81,50.04
  Bottom 0.406: v9.4,50.04 10.16,50.04 10.41,49.78 11.43,49.78 11.68,50.04 v19.81,50.04 v28.19,50.04 49.78,50.04 v50.04,49.78 | 29.08,22.86 v28.19,21.97 | 2.TC5.1 27.56,34.54 29.84,32.26 29.84,28.7 v29.21,28.07
D3  (via drill 0.6)
  Top 0.406: 4.R1.2 57.02,41.02 55.12,39.12 46.61,39.12 40.13,32.64 40.13,25.02 v39.37,24.26 | v33.66,23.5 33.66,24.86 1.MCU1.1
  Bottom 0.406: v39.37,24.26 34.42,24.26 v33.66,23.5
D6  (via drill 0.6)
  Top 0.406: 2.DRIVER.9 10.77,50.52 v10.92,50.67 | 51.94,50.29 v51.94,50.67 52.04,50.57 4.DRIVER.9 | v29.59,50.93 29.59,49.02 29.72,48.9 29.69,48.87 3.DRIVER.9 29.69,38.51 2.TC6.1 31.62,36.58 31.62,34.04 30.96,33.37 1.MCU1.10
  Bottom 0.406: v10.92,50.67 27.43,50.8 27.81,51.18 29.34,51.18 v29.59,50.93 30.1,50.93 30.35,50.67 v51.94,50.67
D7  (via drill 0.6)
  Top 0.406: v28.57,40.64 28.96,40.26 28.96,37.47 30.73,35.69 30.73,34.29 30.16,33.71 1.MCU1.11 | 3.DRIVER.7 28.39,46.43 v28.19,46.23 | 9.4,46.23 v9.27,46.1 9.47,46.3 2.DRIVER.7 | 50.67,46.35 v50.67,46.23 50.74,46.3 4.DRIVER.7
  Bottom 0.406: v28.57,40.64 28.57,45.85 v28.19,46.23 | v28.19,46.23 28.19,47.24 27.81,47.62 10.79,47.62 v9.27,46.1 | v28.19,46.23 29.72,47.75 2.TD7.1 49.15,47.75 v50.67,46.23
GND  (via drill 0.6)  (7 unrouted)
  other vias: 45.72,5.08 45.72,15.49 45.72,25.65 45.72,35.81 50.8,35.81 60.96,25.65 60.96,15.49 60.96,5.33 60.96,61.21 40.64,61.21 35.56,61.21 35.56,66.29 40.64,66.29 20.32,66.29 15.24,66.29 15.24,61.21 20.32,61.21 5.08,35.81 5.08,30.73 5.08,25.65 5.08,20.57 5.08,15.49 5.08,10.41 5.08,5.33 10.16,5.33 50.8,10.41 45.72,20.57 40.64,10.41 45.72,10.41 43.81,45.47 34.16,46.61 36.2,54.74 18.8,54.74 21.21,54.74 42.67,54.61 57.15,54.48 55.63,48.9 17.14,46.48 22.23,38.35 25.02,36.83 33.53,35.05 20.57,34.54 21.46,26.29 35.18,25.91 26.16,27.05 22.86,18.92
  pour Top (rank 2): -1.27,70.99 -1.27,-0.76 -0.25,-1.78 65.02,-1.78 67.69,0.89 67.69,71.63 63.63,75.69 3.17,75.69 -1.4,71.12
  pour Bottom (rank 2): -1.14,75.95 -1.14,-1.02 -0.25,-1.91 66.67,-1.91 68.96,0.38 68.96,71.75 64.52,76.2 -0.89,76.2
MISO
  Top 0.406: 1.MCU1.16 25.38,32.36 25.15,32.13 24.26,32.13 23.75,32.64 14.86,32.64 1.ISPC.MISO
MOSI  (via drill 0.6)
  Top 0.406: 27.05,30.73 v27.3,30.48 26.96,30.83 1.MCU1.15
  Bottom 0.406: 1.ISPC.MOSI 17.27,28.7 18.92,30.35 27.18,30.35 v27.3,30.48
N$1
  Top 0.406: 1.MCU1.20 21.67,28.47 1.C4.1
N$2
  Top 0.406: 2.DRIVER.4 7.52,46.89 7.11,46.48 7.11,44.77 2.C3.1
N$3
  Top 0.406: IC1.15 25.87,11.72 21.84,15.75 15.37,15.75 14.86,15.24 13.15,15.24 0.CON1.D+
N$4
  Top 0.406: IC1.16 26.52,12.85 24.77,14.61 24.77,16.13 24.35,16.54 0.CON1.D-
N$5
  Top 0.406: 2.C4.1 4.7,46.76 2.DRIVER.1
N$6
  Top 0.406: 2.C4.2 5.4,42.61 5.97,43.18 5.97,45.97 6.22,46.22 2.DRIVER.2
N$7
  Top 0.406: IC1.17 27.17,6.79 0.C4.1
N$8
  Top 0.406: 2.C5.1 6.16,49.98 6.87,49.27 2.DRIVER.3
N$9
  Top 0.406: 3.C3.1 26.29,46.23 26.44,46.38 3.DRIVER.4
N$10
  Top 0.406: 2.DRIVER.18 9.47,65.35 9.91,65.79 12.45,65.79 12.83,66.17 12.83,67.44 2.MCON.1
N$11
  Top 0.406: 2.DRIVER.19 8.82,66.1 10.29,67.56 2.MCON.2
N$12  (via drill 0.6)
  Top 0.406: 2.DRIVER.15 11.42,56 v11.94,56.52
  Bottom 0.406: v11.94,56.52 7.87,60.58 2.MCON.3
N$13
  Top 0.406: 2.DRIVER.22 6.87,56.88 6.6,57.15 4.7,57.15 4.06,57.78 4.06,66.29 2.MCON.4
N$14
  Top 0.406: 2.DRIVER.17 10.12,57.58 2.R3.2
N$15
  Top 0.406: 2.DRIVER.20 8.17,57.45 2.R4.2
N$16
  Top 0.406: 3.C4.1 23.62,46.76 3.DRIVER.1
N$18
  Top 0.406: 3.C4.2 24.58,42.61 24.89,42.93 24.89,46.1 25.14,46.35 3.DRIVER.2
N$19
  Top 0.406: 2.DRIVER.8 10.12,45.1 2.R2.2
N$20
  Top 0.406: 3.C5.1 24.95,49.98 25.79,49.14 3.DRIVER.3
N$21
  Top 0.406: 3.MCON.1 31.88,67.18 30.35,65.66 29.08,65.66 28.57,65.15 28.57,56.13 28.39,55.95 3.DRIVER.18
N$22
  Top 0.406: 3.DRIVER.19 27.74,65.97 3.MCON.2
N$23  (via drill 0.6)
  Top 0.406: 30.86,56.26 v31.11,56.52 30.34,55.74 3.DRIVER.15
  Bottom 0.406: 3.MCON.3 26.8,60.83 v31.11,56.52
N$24
  Top 0.406: 3.MCON.4 24,67.56 22.86,66.42 22.86,57.91 23.62,57.15 25.53,57.15 25.79,56.88 3.DRIVER.22
N$25
  Top 0.406: 3.DRIVER.17 29.04,55.46 29.59,56.01 29.59,58.12 3.R3.2
N$26
  Top 0.406: 3.DRIVER.20 27.09,57.45 3.R4.2
N$28
  Top 0.406: 3.DRIVER.8 29.04,45.1 3.R2.2
N$29
  Top 0.406: 4.DRIVER.4 48.79,44.87 4.C3.1
N$30
  Top 0.406: 4.C4.1 45.97,46.76 4.DRIVER.1
N$31
  Top 0.406: 4.DRIVER.2 47.49,42.92 47.12,42.55 46.04,42.55 4.C4.2
N$32
  Top 0.406: 4.DRIVER.3 48.14,48.63 47.88,48.9 47.88,49.4 45.41,49.4 4.C5.1
N$33
  Top 0.406: 4.DRIVER.18 50.74,64.46 53.85,67.56 4.MCON.1
N$34
  Top 0.406: 4.DRIVER.19 50.09,65.97 4.MCON.2
N$35  (via drill 0.6)
  Top 0.406: 4.DRIVER.15 52.69,56.4 v52.32,56.77
  Bottom 0.406: v52.32,56.77 52.32,64.39 4.MCON.3
N$36
  Top 0.406: 4.MCON.4 46.61,67.06 44.58,65.02 44.58,57.66 45.09,57.15 47.75,57.15 48.14,56.76 4.DRIVER.22
N$37
  Top 0.406: 4.DRIVER.17 51.39,57.45 4.R3.2
N$38
  Top 0.406: 4.DRIVER.20 49.44,56.56 4.R4.2
N$40
  Top 0.406: 4.R2.2 51.31,45.34 51.69,45.72 51.69,46.48 51.39,46.78 4.DRIVER.8
N$41
  Top 0.406: 3.C1.1 3.R1.1 34.04,45.24 3.DRIVER.12
N$43
  Top 0.406: 4.DRIVER.12 55.24,47.63 57.02,45.85 4.R1.1 4.C1.1
N$45
  Top 0.406: 2.DRIVER.12 15.11,45.24 2.R1.1 2.C1.1
RXD  (via drill 0.6)
  Top 0.406: 1.MCU1.30 30.16,21.01 v30.1,20.95 | 34.29,18.16 v34.29,18.29 34.32,18.25 IC1.1
  Bottom 0.406: v30.1,20.95 31.62,20.95 v34.29,18.29
SCK  (via drill 0.6)
  Top 0.406: 1.MCU1.17 24.12,30.87 v23.37,31.62
  Bottom 0.406: v23.37,31.62 18.67,31.62 17.02,29.97 14.22,29.97 13.59,29.34 13.59,28.83 1.ISPC.SCK
TXD
  Top 0.406: 1.MCU1.31 30.96,20.23 31.72,19.46 IC1.5